# EAGLE schematic MotorBoard (EAGLE 6.4)
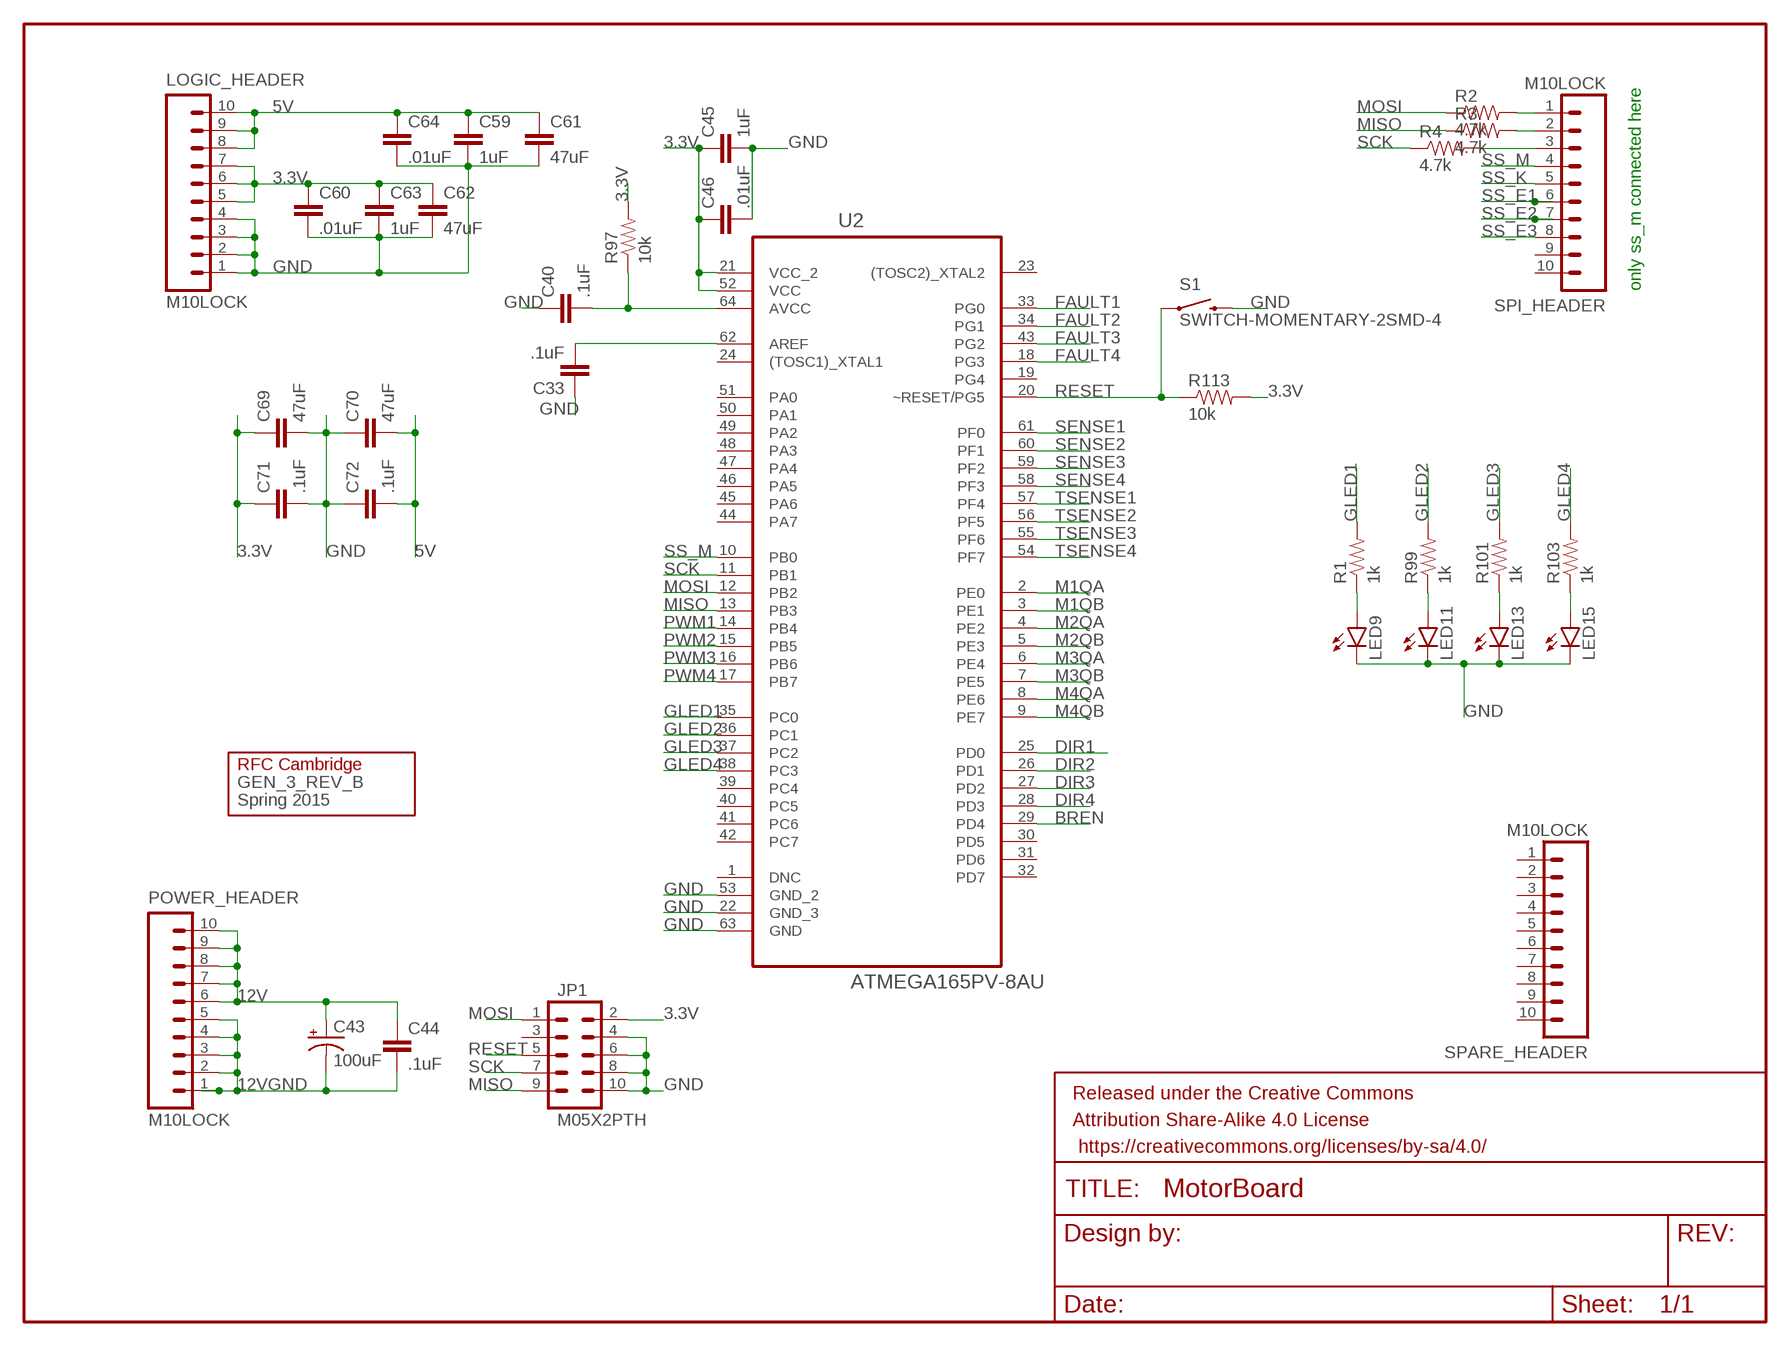
[diagram p0: schematic, sheet 1, part 1 of 2]
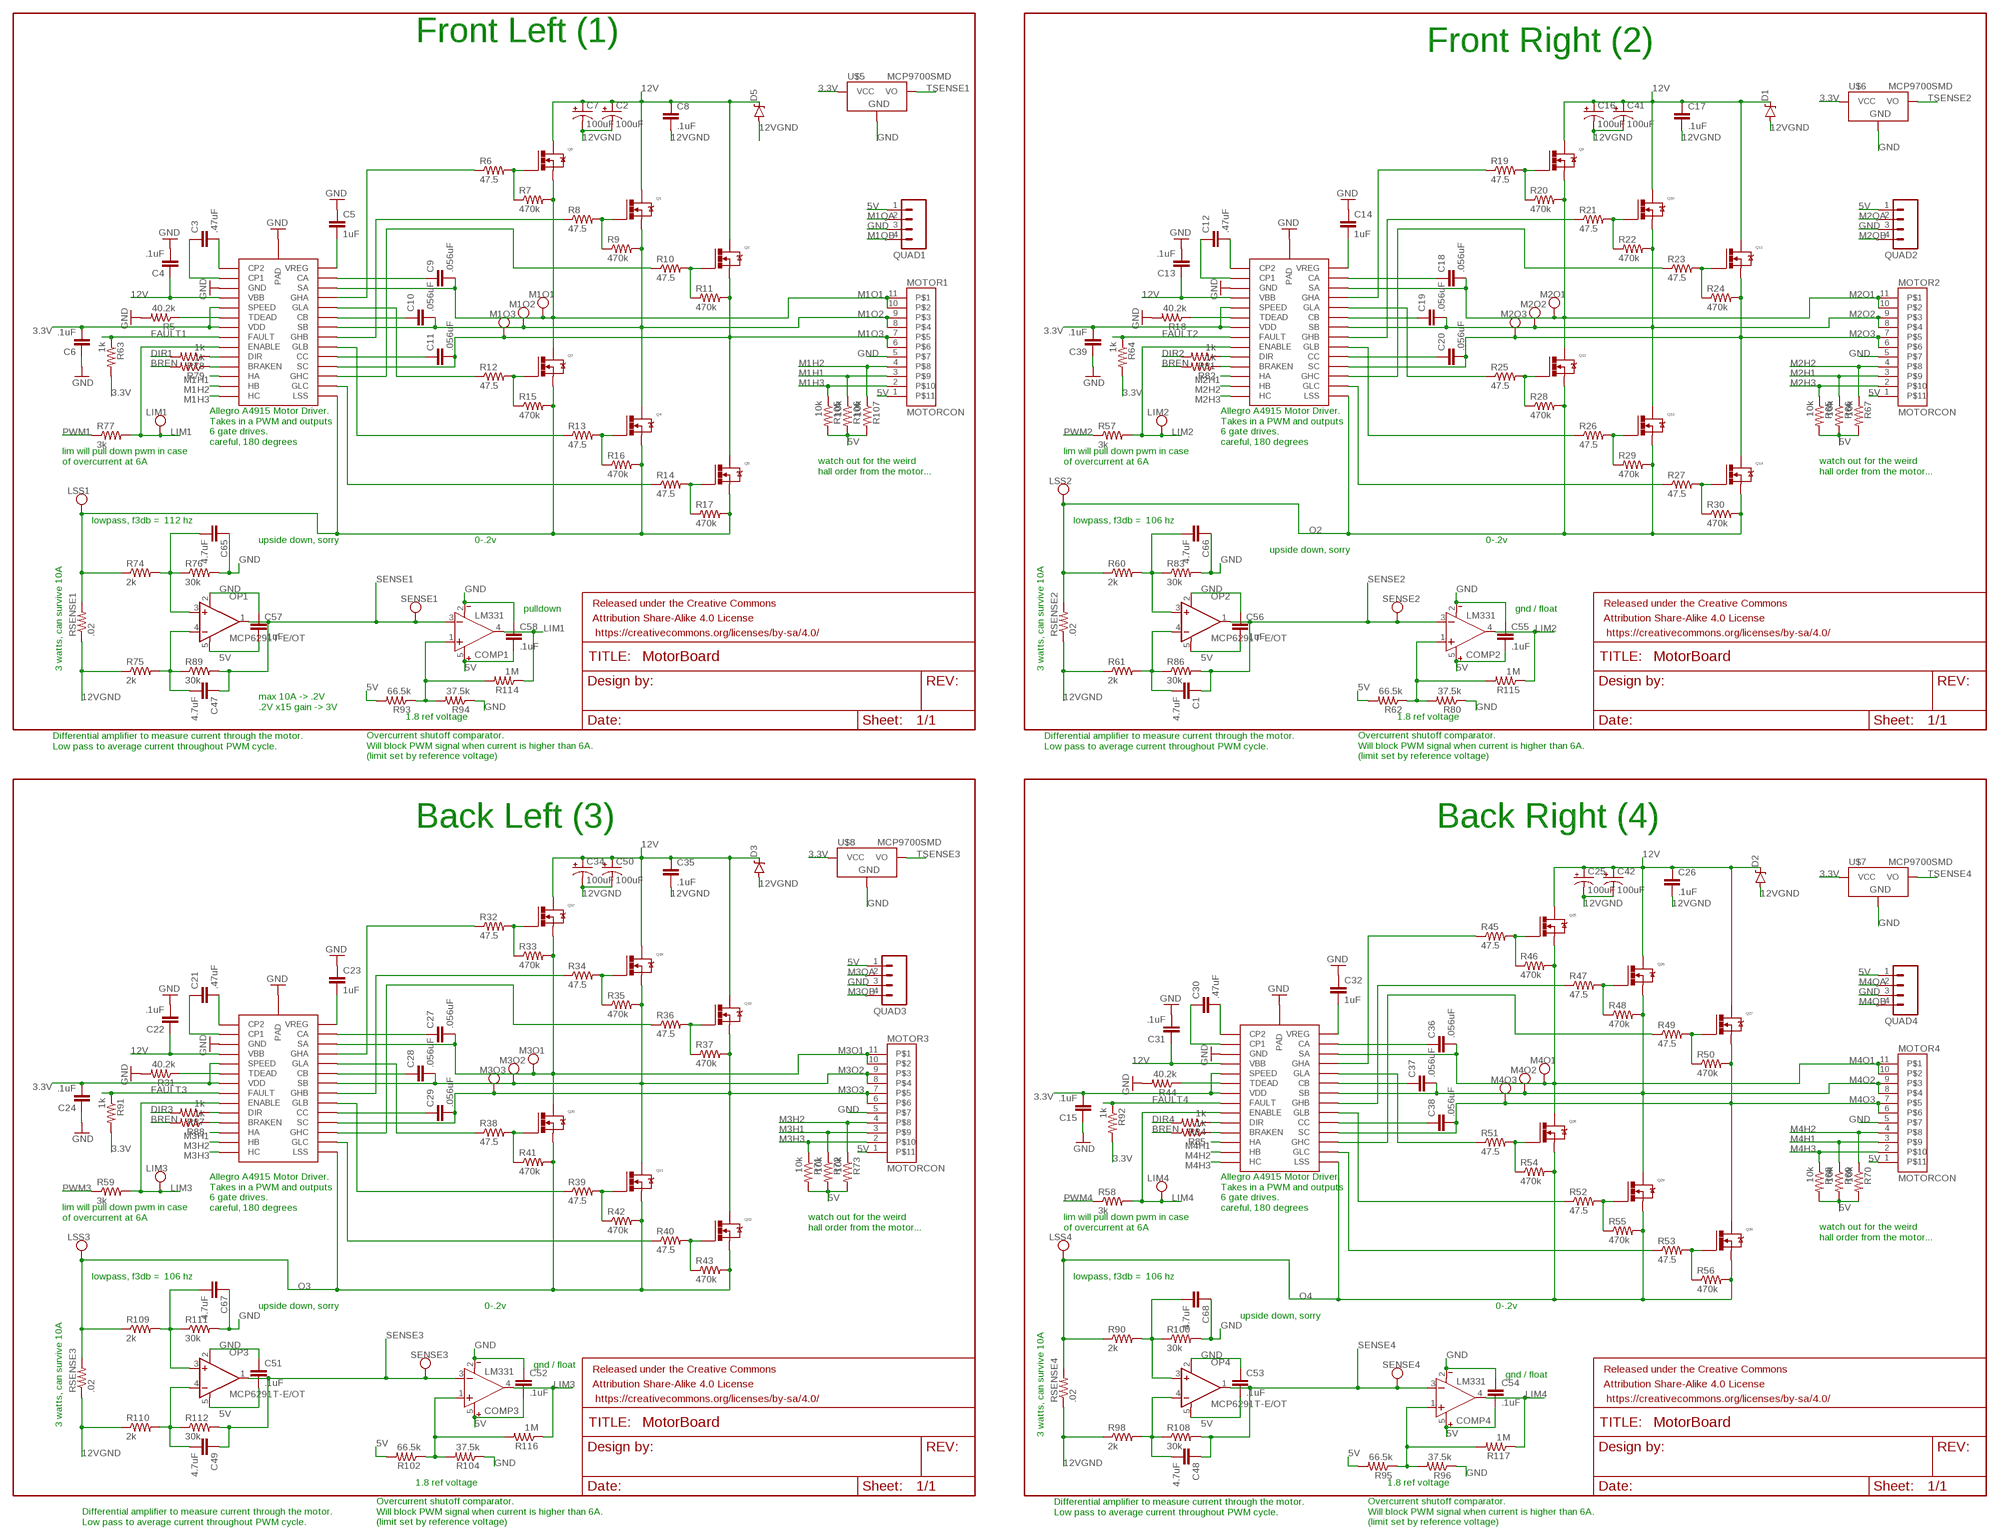
[diagram p1: schematic, sheet 1, part 2 of 2]

## Parts
C1  4.7uF  CAP0805  [0805]
C2  100uF  CAP-POLAR  [PANASONIC_D]
C3  .47uF  CAP0805  [0805]
C4  .1uF  CAP0805  [0805]
C5  1uF  CAP0805  [0805]
C6  .1uF  CAP0805  [0805]
C7  100uF  CAP-POLAR  [PANASONIC_D]
C8  .1uF  CAP0805  [0805]
C9  .056uF  CAP0805  [0805]
C10  .056uF  CAP0805  [0805]
C11  .056uF  CAP0805  [0805]
C12  .47uF  CAP0805  [0805]
C13  .1uF  CAP0805  [0805]
C14  1uF  CAP0805  [0805]
C15  .1uF  CAP0805  [0805]
C16  100uF  CAP-POLAR  [PANASONIC_D]
C17  .1uF  CAP0805  [0805]
C18  .056uF  CAP0805  [0805]
C19  .056uF  CAP0805  [0805]
C20  .056uF  CAP0805  [0805]
C21  .47uF  CAP0805  [0805]
C22  .1uF  CAP0805  [0805]
C23  1uF  CAP0805  [0805]
C24  .1uF  CAP0805  [0805]
C25  100uF  CAP-POLAR  [PANASONIC_D]
C26  .1uF  CAP0805  [0805]
C27  .056uF  CAP0805  [0805]
C28  .056uF  CAP0805  [0805]
C29  .056uF  CAP0805  [0805]
C30  .47uF  CAP0805  [0805]
C31  .1uF  CAP0805  [0805]
C32  1uF  CAP0805  [0805]
C33  .1uF  CAP0805  [0805]
C34  100uF  CAP-POLAR  [PANASONIC_D]
C35  .1uF  CAP0805  [0805]
C36  .056uF  CAP0805  [0805]
C37  .056uF  CAP0805  [0805]
C38  .056uF  CAP0805  [0805]
C39  .1uF  CAP0805  [0805]
C40  .1uF  CAP0805  [0805]
C41  100uF  CAP-POLAR  [PANASONIC_D]
C42  100uF  CAP-POLAR  [PANASONIC_D]
C43  100uF  CAP-POLAR  [PANASONIC_D]
C44  .1uF  CAP0805  [0805]
C45  1uF  CAP0805  [0805]
C46  .01uF  CAP0805  [0805]
C47  4.7uF  CAP0805  [0805]
C48  4.7uF  CAP0805  [0805]
C49  4.7uF  CAP0805  [0805]
C50  100uF  CAP-POLAR  [PANASONIC_D]
C51  .1uF  CAP0805  [0805]
C52  .1uF  CAP0805  [0805]
C53  .1uF  CAP0805  [0805]
C54  .1uF  CAP0805  [0805]
C55  .1uF  CAP0805  [0805]
C56  .1uF  CAP0805  [0805]
C57  .1uF  CAP0805  [0805]
C58  .1uF  CAP0805  [0805]
C59  1uF  CAP0805  [0805]
C60  .01uF  CAP0805  [0805]
C61  47uF  CAP1206  [1206]
C62  47uF  CAP1206  [1206]
C63  1uF  CAP0805  [0805]
C64  .01uF  CAP0805  [0805]
C65  4.7uF  CAP0805  [0805]
C66  4.7uF  CAP0805  [0805]
C67  4.7uF  CAP0805  [0805]
C68  4.7uF  CAP0805  [0805]
C69  47uF  CAP1206  [1206]
C70  47uF  CAP1206  [1206]
C71  .1uF  CAP0805  [0805]
C72  .1uF  CAP0805  [0805]
COMP1  LM331  [SOT23-5]
COMP2  LM331  [SOT23-5]
COMP3  LM331  [SOT23-5]
COMP4  LM331  [SOT23-5]
D1  DIODE-ZENERDO214AC  [DO214AC]
D2  DIODE-ZENERDO214AC  [DO214AC]
D3  DIODE-ZENERDO214AC  [DO214AC]
D5  DIODE-ZENERDO214AC  [DO214AC]
FRAME1  FRAME-LETTER  [CREATIVE_COMMONS]
FRAME2  FRAME-LETTER  [CREATIVE_COMMONS]
FRAME5  FRAME-LETTER  [CREATIVE_COMMONS]
FRAME6  FRAME-LETTER  [CREATIVE_COMMONS]
FRAME7  FRAME-LETTER  [CREATIVE_COMMONS]
GEN_3_REV_B  Spring 2015  LOGO  [LOGO]
JP1  M05X2PTH  [AVR_ICSP]
LED9  LED1206  [LED-1206]
LED11  LED1206  [LED-1206]
LED13  LED1206  [LED-1206]
LED15  LED1206  [LED-1206]
LIM1  TEST_PT  [TESTING_PT]
LIM2  TEST_PT  [TESTING_PT]
LIM3  TEST_PT  [TESTING_PT]
LIM4  TEST_PT  [TESTING_PT]
LOGIC_HEADER  M10LOCK  [1X10_LOCK]
LSS1  TEST_PT  [TESTING_PT]
LSS2  TEST_PT  [TESTING_PT]
LSS3  TEST_PT  [TESTING_PT]
LSS4  TEST_PT  [TESTING_PT]
M1O1  TEST_PT  [TESTING_PT]
M1O2  TEST_PT  [TESTING_PT]
M1O3  TEST_PT  [TESTING_PT]
M2O1  TEST_PT  [TESTING_PT]
M2O2  TEST_PT  [TESTING_PT]
M2O3  TEST_PT  [TESTING_PT]
M3O1  TEST_PT  [TESTING_PT]
M3O2  TEST_PT  [TESTING_PT]
M3O3  TEST_PT  [TESTING_PT]
M4O1  TEST_PT  [TESTING_PT]
M4O2  TEST_PT  [TESTING_PT]
M4O3  TEST_PT  [TESTING_PT]
MOTOR1  MOTORCON  [GEN3CON]
MOTOR2  MOTORCON  [GEN3CON]
MOTOR3  MOTORCON  [GEN3CON]
MOTOR4  MOTORCON  [GEN3CON]
OP1  MCP6291T-E/OT  [SOT23-5]
OP2  MCP6291T-E/OT  [SOT23-5]
OP3  MCP6291T-E/OT  [SOT23-5]
OP4  MCP6291T-E/OT  [SOT23-5]
POWER_HEADER  M10LOCK  [1X10_LOCK]
Q1  N-MOSFET  [DPAK]
Q2  N-MOSFET  [DPAK]
Q3  N-MOSFET  [DPAK]
Q4  N-MOSFET  [DPAK]
Q5  N-MOSFET  [DPAK]
Q6  N-MOSFET  [DPAK]
Q9  N-MOSFET  [DPAK]
Q10  N-MOSFET  [DPAK]
Q11  N-MOSFET  [DPAK]
Q12  N-MOSFET  [DPAK]
Q13  N-MOSFET  [DPAK]
Q14  N-MOSFET  [DPAK]
Q17  N-MOSFET  [DPAK]
Q18  N-MOSFET  [DPAK]
Q19  N-MOSFET  [DPAK]
Q20  N-MOSFET  [DPAK]
Q21  N-MOSFET  [DPAK]
Q22  N-MOSFET  [DPAK]
Q25  N-MOSFET  [DPAK]
Q26  N-MOSFET  [DPAK]
Q27  N-MOSFET  [DPAK]
Q28  N-MOSFET  [DPAK]
Q29  N-MOSFET  [DPAK]
Q30  N-MOSFET  [DPAK]
QUAD1  M04LOCK  [1X04_LOCK]
QUAD2  M04LOCK  [1X04_LOCK]
QUAD3  M04LOCK  [1X04_LOCK]
QUAD4  M04LOCK  [1X04_LOCK]
R1  1k  RESISTOR0805-RES  [0805]
R2  4.7k  RESISTOR0805-RES  [0805]
R3  4.7k  RESISTOR0805-RES  [0805]
R4  4.7k  RESISTOR0805-RES  [0805]
R5  40.2k  RESISTOR0805-RES  [0805]
R6  47.5  RESISTOR0805-RES  [0805]
R7  470k  RESISTOR0805-RES  [0805]
R8  47.5  RESISTOR0805-RES  [0805]
R9  470k  RESISTOR0805-RES  [0805]
R10  47.5  RESISTOR0805-RES  [0805]
R11  470k  RESISTOR0805-RES  [0805]
R12  47.5  RESISTOR0805-RES  [0805]
R13  47.5  RESISTOR0805-RES  [0805]
R14  47.5  RESISTOR0805-RES  [0805]
R15  470k  RESISTOR0805-RES  [0805]
R16  470k  RESISTOR0805-RES  [0805]
R17  470k  RESISTOR0805-RES  [0805]
R18  40.2k  RESISTOR0805-RES  [0805]
R19  47.5  RESISTOR0805-RES  [0805]
R20  470k  RESISTOR0805-RES  [0805]
R21  47.5  RESISTOR0805-RES  [0805]
R22  470k  RESISTOR0805-RES  [0805]
R23  47.5  RESISTOR0805-RES  [0805]
R24  470k  RESISTOR0805-RES  [0805]
R25  47.5  RESISTOR0805-RES  [0805]
R26  47.5  RESISTOR0805-RES  [0805]
R27  47.5  RESISTOR0805-RES  [0805]
R28  470k  RESISTOR0805-RES  [0805]
R29  470k  RESISTOR0805-RES  [0805]
R30  470k  RESISTOR0805-RES  [0805]
R31  40.2k  RESISTOR0805-RES  [0805]
R32  47.5  RESISTOR0805-RES  [0805]
R33  470k  RESISTOR0805-RES  [0805]
R34  47.5  RESISTOR0805-RES  [0805]
R35  470k  RESISTOR0805-RES  [0805]
R36  47.5  RESISTOR0805-RES  [0805]
R37  470k  RESISTOR0805-RES  [0805]
R38  47.5  RESISTOR0805-RES  [0805]
R39  47.5  RESISTOR0805-RES  [0805]
R40  47.5  RESISTOR0805-RES  [0805]
R41  470k  RESISTOR0805-RES  [0805]
R42  470k  RESISTOR0805-RES  [0805]
R43  470k  RESISTOR0805-RES  [0805]
R44  40.2k  RESISTOR0805-RES  [0805]
R45  47.5  RESISTOR0805-RES  [0805]
R46  470k  RESISTOR0805-RES  [0805]
R47  47.5  RESISTOR0805-RES  [0805]
R48  470k  RESISTOR0805-RES  [0805]
R49  47.5  RESISTOR0805-RES  [0805]
R50  470k  RESISTOR0805-RES  [0805]
R51  47.5  RESISTOR0805-RES  [0805]
R52  47.5  RESISTOR0805-RES  [0805]
R53  47.5  RESISTOR0805-RES  [0805]
R54  470k  RESISTOR0805-RES  [0805]
R55  470k  RESISTOR0805-RES  [0805]
R56  470k  RESISTOR0805-RES  [0805]
R57  3k  RESISTOR0805-RES  [0805]
R58  3k  RESISTOR0805-RES  [0805]
R59  3k  RESISTOR0805-RES  [0805]
R60  2k  RESISTOR0805-RES  [0805]
R61  2k  RESISTOR0805-RES  [0805]
R62  66.5k  RESISTOR0805-RES  [0805]
R63  1k  RESISTOR0805-RES  [0805]
R64  1k  RESISTOR0805-RES  [0805]
R65  10k  RESISTOR0805-RES  [0805]
R66  10k  RESISTOR0805-RES  [0805]
R67  10k  RESISTOR0805-RES  [0805]
R68  10k  RESISTOR0805-RES  [0805]
R69  10k  RESISTOR0805-RES  [0805]
R70  10k  RESISTOR0805-RES  [0805]
R71  10k  RESISTOR0805-RES  [0805]
R72  10k  RESISTOR0805-RES  [0805]
R73  10k  RESISTOR0805-RES  [0805]
R74  2k  RESISTOR0805-RES  [0805]
R75  2k  RESISTOR0805-RES  [0805]
R76  30k  RESISTOR0805-RES  [0805]
R77  3k  RESISTOR0805-RES  [0805]
R78  1k  RESISTOR0805-RES  [0805]
R79  1k  RESISTOR0805-RES  [0805]
R80  37.5k  RESISTOR0805-RES  [0805]
R81  1k  RESISTOR0805-RES  [0805]
R82  1k  RESISTOR0805-RES  [0805]
R83  30k  RESISTOR0805-RES  [0805]
R84  1k  RESISTOR0805-RES  [0805]
R85  1k  RESISTOR0805-RES  [0805]
R86  30k  RESISTOR0805-RES  [0805]
R87  1k  RESISTOR0805-RES  [0805]
R88  1k  RESISTOR0805-RES  [0805]
R89  30k  RESISTOR0805-RES  [0805]
R90  2k  RESISTOR0805-RES  [0805]
R91  1k  RESISTOR0805-RES  [0805]
R92  1k  RESISTOR0805-RES  [0805]
R93  66.5k  RESISTOR0805-RES  [0805]
R94  37.5k  RESISTOR0805-RES  [0805]
R95  66.5k  RESISTOR0805-RES  [0805]
R96  37.5k  RESISTOR0805-RES  [0805]
R97  10k  RESISTOR0805-RES  [0805]
R98  2k  RESISTOR0805-RES  [0805]
R99  1k  RESISTOR0805-RES  [0805]
R100  30k  RESISTOR0805-RES  [0805]
R101  1k  RESISTOR0805-RES  [0805]
R102  66.5k  RESISTOR0805-RES  [0805]
R103  1k  RESISTOR0805-RES  [0805]
R104  37.5k  RESISTOR0805-RES  [0805]
R105  10k  RESISTOR0805-RES  [0805]
R106  10k  RESISTOR0805-RES  [0805]
R107  10k  RESISTOR0805-RES  [0805]
R108  30k  RESISTOR0805-RES  [0805]
R109  2k  RESISTOR0805-RES  [0805]
R110  2k  RESISTOR0805-RES  [0805]
R111  30k  RESISTOR0805-RES  [0805]
R112  30k  RESISTOR0805-RES  [0805]
R113  10k  RESISTOR0805-RES  [0805]
R114  1M  RESISTOR0805-RES  [0805]
R115  1M  RESISTOR0805-RES  [0805]
R116  1M  RESISTOR0805-RES  [0805]
R117  1M  RESISTOR0805-RES  [0805]
RSENSE1  .02  RESISTOR2512  [R2512]
RSENSE2  .02  RESISTOR2512  [R2512]
RSENSE3  .02  RESISTOR2512  [R2512]
RSENSE4  .02  RESISTOR2512  [R2512]
S1  SWITCH-MOMENTARY-2SMD-4  [TACTILE_SWITCH_TALL]
SENSE1  TEST_PT  [TESTING_PT]
SENSE2  TEST_PT  [TESTING_PT]
SENSE3  TEST_PT  [TESTING_PT]
SENSE4  TEST_PT  [TESTING_PT]
SPARE_HEADER  M10LOCK  [1X10_LOCK]
SPI_HEADER  M10LOCK  [1X10_LOCK]
U2  ATMEGA165PV-8AU  [QFP80P1600X1600X120-64N]
U$1  A4915  [TSSOP28-GROUNDPAD]
U$2  A4915  [TSSOP28-GROUNDPAD]
U$3  A4915  [TSSOP28-GROUNDPAD]
U$4  A4915  [TSSOP28-GROUNDPAD]
U$5  MCP9700SMD  [SOT23-3]
U$6  MCP9700SMD  [SOT23-3]
U$7  MCP9700SMD  [SOT23-3]
U$8  MCP9700SMD  [SOT23-3]

## Nets
3.3V: C6.2 C15.2 C24.2 C39.2 C45.1 C46.1 C60.1 C62.1 C63.1 C69.1 C71.1 JP1.2 LOGIC_HEADER.5 LOGIC_HEADER.6 LOGIC_HEADER.7 R63.2 R64.2 R91.2 R92.2 R97.2 R113.2 U2.21(VCC_2) U2.52(VCC) U$1.SPEED U$1.VDD U$2.SPEED U$2.VDD U$3.SPEED U$3.VDD U$4.SPEED U$4.VDD U$5.1(VCC) U$6.1(VCC) U$7.1(VCC) U$8.1(VCC)
5V: C51.2 C52.2 C53.2 C54.2 C55.2 C56.2 C57.2 C58.2 C59.1 C61.1 C64.1 C70.2 C72.2 COMP1.5(V+) COMP2.5(V+) COMP3.5(V+) COMP4.5(V+) LOGIC_HEADER.8 LOGIC_HEADER.9 LOGIC_HEADER.10 MOTOR1.1 MOTOR2.1 MOTOR3.1 MOTOR4.1 OP1.5(V+) OP2.5(V+) OP3.5(V+) OP4.5(V+) QUAD1.1 QUAD2.1 QUAD3.1 QUAD4.1 R62.2 R65.2 R66.2 R67.2 R68.2 R69.2 R70.2 R71.2 R72.2 R73.2 R93.2 R95.2 R102.2 R105.2 R106.2 R107.2
12V: C2.+ C4.1 C7.+ C8.1 C13.1 C16.+ C17.1 C22.1 C25.+ C26.1 C31.1 C34.+ C35.1 C41.+ C42.+ C43.+ C44.1 C50.+ D1.C D2.C D3.C D5.C POWER_HEADER.6 POWER_HEADER.7 POWER_HEADER.8 POWER_HEADER.9 POWER_HEADER.10 Q1.DRAIN Q2.DRAIN Q6.DRAIN Q9.DRAIN Q10.DRAIN Q11.DRAIN Q17.DRAIN Q18.DRAIN Q19.DRAIN Q25.DRAIN Q26.DRAIN Q27.DRAIN U$1.VBB U$2.VBB U$3.VBB U$4.VBB
12VGND: C2.- C7.- C8.2 C16.- C17.2 C25.- C26.2 C34.- C35.2 C41.- C42.- C43.- C44.2 C50.- D1.A D2.A D3.A D5.A POWER_HEADER.1 POWER_HEADER.2 POWER_HEADER.3 POWER_HEADER.4 POWER_HEADER.5 R61.1 R75.1 R98.1 R110.1 RSENSE1.1 RSENSE2.1 RSENSE3.1 RSENSE4.1
AREF: C33.2 U2.62(AREF)
AVCC: C40.2 R97.1 U2.64(AVCC)
BREN: R79.2 R82.2 R85.2 R88.2 U2.29(PD4)
CP1: C3.1 U$4.CP1
CP2: C3.2 U$4.CP2
DIR1: R78.2 U2.25(PD0)
DIR2: R81.2 U2.26(PD1)
DIR3: R87.2 U2.27(PD2)
DIR4: R84.2 U2.28(PD3)
FAULT1: R63.1 U2.33(PG0) U$4.FAULT
FAULT2: R64.1 U2.34(PG1) U$1.FAULT
FAULT3: R91.1 U2.43(PG2) U$2.FAULT
FAULT4: R92.1 U2.18(PG3) U$3.FAULT
GLED1: R1.2 U2.35(PC0)
GLED2: R99.2 U2.36(PC1)
GLED3: R101.2 U2.37(PC2)
GLED4: R103.2 U2.38(PC3)
GND: C4.2 C5.1 C6.1 C13.2 C14.1 C15.1 C22.2 C23.1 C24.1 C31.2 C32.1 C33.1 C39.1 C40.1 C45.2 C46.2 C51.1 C52.1 C53.1 C54.1 C55.1 C56.1 C57.1 C58.1 C59.2 C60.2 C61.2 C62.2 C63.2 C64.2 C65.1 C66.1 C67.1 C68.1 C69.2 C70.1 C71.2 C72.1 COMP1.2(V-) COMP2.2(V-) COMP3.2(V-) COMP4.2(V-) JP1.4 JP1.6 JP1.8 JP1.10 LED9.C LED11.C LED13.C LED15.C LOGIC_HEADER.1 LOGIC_HEADER.2 LOGIC_HEADER.3 LOGIC_HEADER.4 MOTOR1.5 MOTOR2.5 MOTOR3.5 MOTOR4.5 OP1.2(V-) OP2.2(V-) OP3.2(V-) OP4.2(V-) QUAD1.3 QUAD2.3 QUAD3.3 QUAD4.3 R5.2 R18.2 R31.2 R44.2 R76.2 R80.1 R83.2 R94.1 R96.1 R100.2 R104.1 R111.2 S1.B2 U2.22(GND_3) U2.53(GND_2) U2.63(GND) U$1.GND U$1.PAD U$2.GND U$2.PAD U$3.GND U$3.PAD U$4.GND U$4.PAD U$5.3(GND) U$6.3(GND) U$7.3(GND) U$8.3(GND)
LIM1: COMP1.4(OUT) LIM1.P$1 R77.2 R114.1 U$4.ENABLE
LIM2: COMP2.4(OUT) LIM2.P$1 R57.2 R115.1 U$1.ENABLE
LIM3: COMP3.4(OUT) LIM3.P$1 R59.2 R116.1 U$2.ENABLE
LIM4: COMP4.4(OUT) LIM4.P$1 R58.2 R117.1 U$3.ENABLE
M1H1: MOTOR1.3 R106.1 U$4.HA
M1H2: MOTOR1.4 R107.1 U$4.HB
M1H3: MOTOR1.2 R105.1 U$4.HC
M1O1: C9.2 M1O1.P$1 MOTOR1.10 MOTOR1.11 Q3.DRAIN Q6.SOURCE R7.2 U$4.SA
M1O2: C10.2 M1O2.P$1 MOTOR1.8 MOTOR1.9 Q1.SOURCE Q4.DRAIN R9.2 U$4.SB
M1O3: C11.2 M1O3.P$1 MOTOR1.6 MOTOR1.7 Q2.SOURCE Q5.DRAIN R11.2 U$4.SC
M1QA: QUAD1.2 U2.2(PE0)
M1QB: QUAD1.4 U2.3(PE1)
M2H1: MOTOR2.3 R66.1 U$1.HA
M2H2: MOTOR2.4 R67.1 U$1.HB
M2H3: MOTOR2.2 R65.1 U$1.HC
M2O1: C18.2 M2O1.P$1 MOTOR2.10 MOTOR2.11 Q9.SOURCE Q12.DRAIN R20.2 U$1.SA
M2O2: C19.2 M2O2.P$1 MOTOR2.8 MOTOR2.9 Q10.SOURCE Q13.DRAIN R22.2 U$1.SB
M2O3: C20.2 M2O3.P$1 MOTOR2.6 MOTOR2.7 Q11.SOURCE Q14.DRAIN R24.2 U$1.SC
M2QA: QUAD2.2 U2.4(PE2)
M2QB: QUAD2.4 U2.5(PE3)
M3H1: MOTOR3.3 R72.1 U$2.HA
M3H2: MOTOR3.4 R73.1 U$2.HB
M3H3: MOTOR3.2 R71.1 U$2.HC
M3O1: C27.2 M3O1.P$1 MOTOR3.10 MOTOR3.11 Q17.SOURCE Q20.DRAIN R33.2 U$2.SA
M3O2: C28.2 M3O2.P$1 MOTOR3.8 MOTOR3.9 Q18.SOURCE Q21.DRAIN R35.2 U$2.SB
M3O3: C29.2 M3O3.P$1 MOTOR3.6 MOTOR3.7 Q19.SOURCE Q22.DRAIN R37.2 U$2.SC
M3QA: QUAD3.2 U2.6(PE4)
M3QB: QUAD3.4 U2.7(PE5)
M4H1: MOTOR4.3 R69.1 U$3.HA
M4H2: MOTOR4.4 R70.1 U$3.HB
M4H3: MOTOR4.2 R68.1 U$3.HC
M4O1: C36.2 M4O1.P$1 MOTOR4.10 MOTOR4.11 Q25.SOURCE Q28.DRAIN R46.2 U$3.SA
M4O2: C37.2 M4O2.P$1 MOTOR4.8 MOTOR4.9 Q26.SOURCE Q29.DRAIN R48.2 U$3.SB
M4O3: C38.2 M4O3.P$1 MOTOR4.6 MOTOR4.7 Q27.SOURCE Q30.DRAIN R50.2 U$3.SC
M4QA: QUAD4.2 U2.8(PE6)
M4QB: QUAD4.4 U2.9(PE7)
MISO: JP1.9 R3.1 U2.13(PB3)
MOSI: JP1.1 R2.1 U2.12(PB2)
N$1: LED9.A R1.1
N$2: C66.2 OP2.3(+IN) R60.2 R83.1
N$3: R3.2 SPI_HEADER.2
N$4: R4.2 SPI_HEADER.3
N$5: C5.2 U$4.VREG
N$6: Q6.GATE R6.2 R7.1
N$7: Q1.GATE R8.2 R9.1
N$10: Q2.GATE R10.2 R11.1
N$11: Q3.GATE R12.2 R15.1
N$13: Q4.GATE R13.2 R16.1
N$14: Q5.GATE R14.2 R17.1
N$15: C1.2 OP2.4(-IN) R61.2 R86.1
N$16: R6.1 U$4.GHA
N$17: R14.1 U$4.GLC
N$18: R13.1 U$4.GLB
N$19: R12.1 U$4.GLA
N$20: R8.1 U$4.GHB
N$21: R10.1 U$4.GHC
N$22: COMP2.1(IN+) R62.1 R80.2 R115.2
N$23: C12.1 U$1.CP1
N$24: C11.1 U$4.CC
N$25: C12.2 U$1.CP2
N$26: R18.1 U$1.TDEAD
N$27: C20.1 U$1.CC
N$28: C10.1 U$4.CB
N$29: C19.1 U$1.CB
N$30: C18.1 U$1.CA
N$31: C14.2 U$1.VREG
N$32: C9.1 U$4.CA
N$33: Q9.GATE R19.2 R20.1
N$34: Q10.GATE R21.2 R22.1
N$35: Q11.GATE R23.2 R24.1
N$36: Q12.GATE R25.2 R28.1
N$37: Q13.GATE R26.2 R29.1
N$38: Q14.GATE R27.2 R30.1
N$39: R19.1 U$1.GHA
N$40: R27.1 U$1.GLC
N$41: R26.1 U$1.GLB
N$42: R25.1 U$1.GLA
N$43: R21.1 U$1.GHB
N$44: R23.1 U$1.GHC
N$45: R2.2 SPI_HEADER.1
N$46: C65.2 OP1.3(+IN) R74.2 R76.1
N$47: C21.1 U$2.CP1
N$48: C21.2 U$2.CP2
N$49: R31.1 U$2.TDEAD
N$50: C29.1 U$2.CC
N$51: C28.1 U$2.CB
N$52: C27.1 U$2.CA
N$53: C23.2 U$2.VREG
N$54: Q17.GATE R32.2 R33.1
N$55: Q18.GATE R34.2 R35.1
N$56: Q19.GATE R36.2 R37.1
N$57: Q20.GATE R38.2 R41.1
N$58: Q21.GATE R39.2 R42.1
N$59: Q22.GATE R40.2 R43.1
N$60: R32.1 U$2.GHA
N$61: R40.1 U$2.GLC
N$62: R39.1 U$2.GLB
N$63: R38.1 U$2.GLA
N$64: R34.1 U$2.GHB
N$65: R36.1 U$2.GHC
N$66: COMP1.1(IN+) R93.1 R94.2 R114.2
N$67: C68.2 OP4.3(+IN) R90.2 R100.1
N$68: C30.1 U$3.CP1
N$69: C30.2 U$3.CP2
N$70: R44.1 U$3.TDEAD
N$71: C38.1 U$3.CC
N$72: C37.1 U$3.CB
N$73: C36.1 U$3.CA
N$74: C32.2 U$3.VREG
N$75: Q25.GATE R45.2 R46.1
N$76: Q26.GATE R47.2 R48.1
N$77: Q27.GATE R49.2 R50.1
N$78: Q28.GATE R51.2 R54.1
N$79: Q29.GATE R52.2 R55.1
N$80: Q30.GATE R53.2 R56.1
N$81: R45.1 U$3.GHA
N$82: R53.1 U$3.GLC
N$83: R52.1 U$3.GLB
N$84: R51.1 U$3.GLA
N$85: R47.1 U$3.GHB
N$86: R49.1 U$3.GHC
N$87: C48.2 OP4.4(-IN) R98.2 R108.1
N$88: COMP4.1(IN+) R95.1 R96.2 R117.2
N$89: C67.2 OP3.3(+IN) R109.2 R111.1
N$90: C49.2 OP3.4(-IN) R110.2 R112.1
N$91: COMP3.1(IN+) R102.1 R104.2 R116.2
N$92: C47.2 OP1.4(-IN) R75.2 R89.1
N$98: R78.1 U$4.DIR
N$99: R79.1 U$4.BRAKEN
N$101: R81.1 U$1.DIR
N$102: R82.1 U$1.BRAKEN
N$104: R84.1 U$3.DIR
N$105: R85.1 U$3.BRAKEN
N$106: R88.1 U$2.BRAKEN
N$107: R87.1 U$2.DIR
N$114: LED11.A R99.1
N$117: LED13.A R101.1
N$119: LED15.A R103.1
O1: LSS1.P$1 Q3.SOURCE Q4.SOURCE Q5.SOURCE R15.2 R16.2 R17.2 R74.1 RSENSE1.2 U$4.LSS
O2: LSS2.P$1 Q12.SOURCE Q13.SOURCE Q14.SOURCE R28.2 R29.2 R30.2 R60.1 RSENSE2.2 U$1.LSS
O3: LSS3.P$1 Q20.SOURCE Q21.SOURCE Q22.SOURCE R41.2 R42.2 R43.2 R109.1 RSENSE3.2 U$2.LSS
O4: LSS4.P$1 Q28.SOURCE Q29.SOURCE Q30.SOURCE R54.2 R55.2 R56.2 R90.1 RSENSE4.2 U$3.LSS
PWM1: R77.1 U2.14(PB4)
PWM2: R57.1 U2.15(PB5)
PWM3: R59.1 U2.16(PB6)
PWM4: R58.1 U2.17(PB7)
RESET: JP1.5 R113.1 S1.A2 U2.20(~RESET/PG5)
SCK: JP1.7 R4.1 U2.11(PB1)
SENSE1: C47.1 COMP1.3(IN-) OP1.1(OUT) R89.2 SENSE1.P$1 U2.61(PF0)
SENSE2: C1.1 COMP2.3(IN-) OP2.1(OUT) R86.2 SENSE2.P$1 U2.60(PF1)
SENSE3: C49.1 COMP3.3(IN-) OP3.1(OUT) R112.2 SENSE3.P$1 U2.59(PF2)
SENSE4: C48.1 COMP4.3(IN-) OP4.1(OUT) R108.2 SENSE4.P$1 U2.58(PF3)
SS_E1: SPI_HEADER.6
SS_E2: SPI_HEADER.7
SS_E3: SPI_HEADER.8
SS_K: SPI_HEADER.5
SS_M: SPI_HEADER.4 U2.10(PB0)
TDEAD: R5.1 U$4.TDEAD
TSENSE1: U2.57(PF4) U$5.2(VO)
TSENSE2: U2.56(PF5) U$6.2(VO)
TSENSE3: U2.55(PF6) U$8.2(VO)
TSENSE4: U2.54(PF7) U$7.2(VO)
Unconnected: JP1.3 SPARE_HEADER.1 SPARE_HEADER.2 SPARE_HEADER.3 SPARE_HEADER.4 SPARE_HEADER.5 SPARE_HEADER.6 SPARE_HEADER.7 SPARE_HEADER.8 SPARE_HEADER.9 SPARE_HEADER.10 SPI_HEADER.9 SPI_HEADER.10 U2.1(DNC) U2.19(PG4) U2.23((TOSC2)_XTAL2) U2.24((TOSC1)_XTAL1) U2.30(PD5) U2.31(PD6) U2.32(PD7) U2.39(PC4) U2.40(PC5) U2.41(PC6) U2.42(PC7) U2.44(PA7) U2.45(PA6) U2.46(PA5) U2.47(PA4) U2.48(PA3) U2.49(PA2) U2.50(PA1) U2.51(PA0)

## Notes on the sheet
- Front Left (1) | Front Right (2)
- Allegro A4915 Motor Driver.
  Takes in a PWM and outputs 
  6 gate drives.
  careful, 180 degrees
- Allegro A4915 Motor Driver.
  Takes in a PWM and outputs 
  6 gate drives.
  careful, 180 degrees
- lim will pull down pwm in case 
  of overcurrent at 6A
- lim will pull down pwm in case 
  of overcurrent at 6A
- watch out for the weird 
  hall order from the motor...
- watch out for the weird 
  hall order from the motor...
- lowpass, f3db =  112 hz | lowpass, f3db =  106 hz
- upside down, sorry | 0-.2v | 0-.2v
- upside down, sorry
- pulldown | gnd / float
- 3 watts, can survive 10A | 3 watts, can survive 10A
- max 10A -> .2V
  .2V x15 gain -> 3V
- 1.8 ref voltage | 1.8 ref voltage
- Differential amplifier to measure current through the motor. 
  Low pass to average current throughout PWM cycle.
- Differential amplifier to measure current through the motor. 
  Low pass to average current throughout PWM cycle.
- Overcurrent shutoff comparator.
  Will block PWM signal when current is higher than 6A.
  (limit set by reference voltage)
- Overcurrent shutoff comparator.
  Will block PWM signal when current is higher than 6A.
  (limit set by reference voltage)
- Back Left (3) | Back Right (4)
- only ss_m connected here
- Allegro A4915 Motor Driver.
  Takes in a PWM and outputs 
  6 gate drives.
  careful, 180 degrees
- Allegro A4915 Motor Driver.
  Takes in a PWM and outputs 
  6 gate drives.
  careful, 180 degrees
- lim will pull down pwm in case 
  of overcurrent at 6A
- watch out for the weird 
  hall order from the motor...
- lim will pull down pwm in case 
  of overcurrent at 6A
- watch out for the weird 
  hall order from the motor...
- lowpass, f3db =  106 hz | lowpass, f3db =  106 hz
- upside down, sorry | 0-.2v | 0-.2v
- upside down, sorry
- gnd / float
- gnd / float
- 3 watts, can survive 10A
- 3 watts, can survive 10A
- 1.8 ref voltage | 1.8 ref voltage
- Differential amplifier to measure current through the motor. 
  Low pass to average current throughout PWM cycle.
- Differential amplifier to measure current through the motor. 
  Low pass to average current throughout PWM cycle.
- Overcurrent shutoff comparator.
  Will block PWM signal when current is higher than 6A.
  (limit set by reference voltage)
- Overcurrent shutoff comparator.
  Will block PWM signal when current is higher than 6A.
  (limit set by reference voltage)

## Library data of the parts
C1 C3-C6 C8-C15 C17-C24 C26-C32 C35-C39 C44 C47-C49 C51-C58 C65-C68 = SparkFun-Passives:CAP: Capacitor Standard 0603 ceramic capacitor, and 0.1" leaded capacitor.
C2 C7 C16 C25 C34 C41-C43 C50 = gen3:CAP-POLAR: Cap Alum Polarized Digikey: 493-3953-1-ND low impedence, low ceiling cap; PROD_ID: CAP-10547
C33 C40 C45 C46 C59-C64 C69-C72 = SparkFun-Capacitors:CAP: Capacitor Standard 0603 ceramic capacitor, and 0.1" leaded capacitor.
COMP1-COMP4 = gen3:LM331: LM331 Single Comparator Digikey: 296-6633-1-ND
D1-D3 D5 = gen3:DIODE-ZENER: Zener Diode Production Part - 8199 3.4V Zener Voltage
FRAME1 FRAME2 FRAME5-FRAME7 = SparkFun-Aesthetics:FRAME-LETTER: Schematic Frame Standard 8.5x11 US Letter frame
GEN_3_REV_B = gen3:LOGO
JP1 = SparkFun-Connectors:M05X2: Header 5x2 Standard 10-pin dual row 0.1" header. Commonly used with AVR-ISP. Use with Spark Fun Electronics SKU: PRT-00778
LED9 LED11 LED13 LED15 = SparkFun-LED:LED: LEDs Standard schematic elements and footprints for 5mm, 3mm, 1206, and 0603 sized LEDs. 5mm - Spark Fun Electronics SKU : COM-00529 (and others)
LIM1-LIM4 LSS1-LSS4 M1O1-M1O3 M2O1-M2O3 M3O1-M3O3 M4O1-M4O3 SENSE1-SENSE4 = gen3:TEST_PT: Testing Point Use to probe a signal
LOGIC_HEADER POWER_HEADER SPARE_HEADER SPI_HEADER = SparkFun-Connectors:M10: Header 10 Standard 10-pin 0.1" header. Use with straight break away headers (SKU : PRT-00116), right angle break away headers (PRT-00553), swiss pins (PRT-00743), machine pins (PRT-00117), and female headers (PRT-00115).
MOTOR1-MOTOR4 = gen3:MOTORCON: Motor Connector bottom side connector for ribbon cable
OP1-OP4 = SparkFun-AnalogIC:MCP6291: Rail to rail OpAmp with 10MHz GBP; PROD_ID: IC-11991
Q1-Q6 Q9-Q14 Q17-Q22 Q25-Q30 = rfc:N-MOSFET: N-Channel Power Mosfet
QUAD1-QUAD4 = SparkFun-Connectors:M04: Header 4 Standard 4-pin 0.1" header. Use with straight break away headers (SKU : PRT-00116), right angle break away headers (PRT-00553), swiss pins (PRT-00743), machine pins (PRT-00117), and female headers (PRT-00115). Molex polarized connector foot print use with SKU : PRT-08231 with associated crimp pins and housings. 1MM SMD Version SKU: PRT-10208
R1-R4 R60 R61 R74-R76 R83 R86 R89 R90 R97-R101 R103 R108-R113 = SparkFun-Passives:RESISTOR: Resistor Basic schematic elements and footprints for 0603, 1206, and PTH resistors.
R5-R59 R62-R73 R77-R82 R84 R85 R87 R88 R91-R96 R102 R104-R107 R114-R117 RSENSE1-RSENSE4 = SparkFun-Resistors:RESISTOR: Resistor Basic schematic elements and footprints for 0603, 1206, and PTH resistors.
S1 = SparkFun-Electromechanical:SWITCH-MOMENTARY-2: Various NO switches- pushbuttons, reed, etc; PROD_ID: SWCH-11966
U2 = Atmel_By_element14_Batch_1-00:ATMEGA165PV-8AU: 8-bit Microcontroller with 16K Bytes In-System Programmable Flash; MPN: ATMEGA165PV-8AU; OC_FARNELL: 1455104; OC_NEWARK: 58M3730; PACKAGE: TQFP-64; SUPPLIER: Atmel
U$1-U$4 = rfc:A4915: Allegro A4915 3 phase motor control driver with built in hall effect commutation
U$5-U$8 = SparkFun-Sensors:MCP9700: Analog-output temperature sensor; PROD_ID: IC-08917